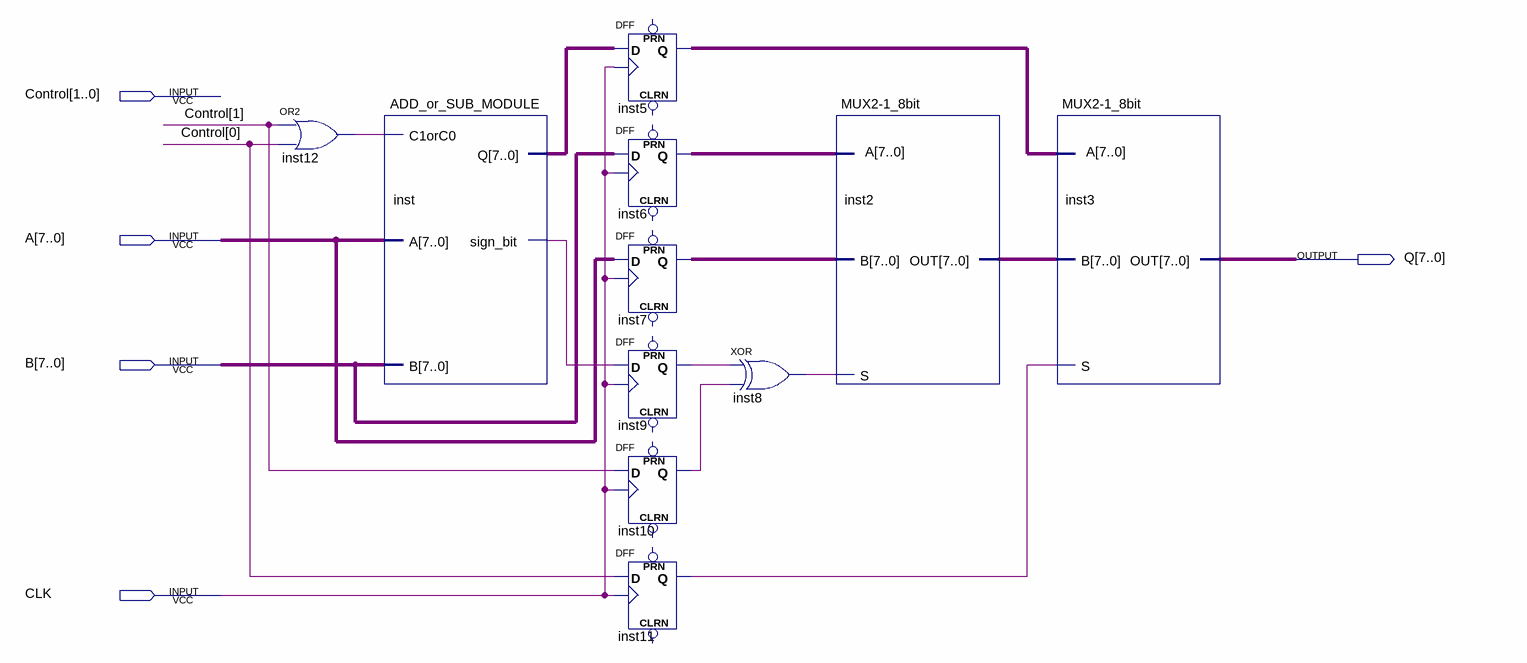
[diagram p0: schematic sheet]
// Quartus schematic AU_2.bdf as structural Verilog: 11 symbols, 5 pins
module AU_2 (
  input  [1:0] Control,
  input  [7:0] A,
  input  [7:0] B,
  input  CLK,
  output [7:0] Q
);

  wire inst8_out, inst9_q, inst10_q, inst11_q, inst12_out, inst_sign_bit;
  wire [7:0] inst2_out, inst5_q, inst6_q, inst7_q, inst_q;

  or inst12 (inst12_out, Control[1], Control[0]);
  ADD_or_SUB_MODULE inst (.B(B), .A(A), .C1orC0(inst12_out), .sign_bit(inst_sign_bit), .Q(inst_q));
  DFF inst5[7:0] (.CLK(CLK), .D(inst_q), .Q(inst5_q));  // open: CLRN, PRN
  DFF inst6[7:0] (.CLK(CLK), .D(B), .Q(inst6_q));  // open: CLRN, PRN
  DFF inst7[7:0] (.CLK(CLK), .D(A), .Q(inst7_q));  // open: CLRN, PRN
  DFF inst9 (.CLK(CLK), .D(inst_sign_bit), .Q(inst9_q));  // open: CLRN, PRN
  DFF inst10 (.CLK(CLK), .D(Control[1]), .Q(inst10_q));  // open: CLRN, PRN
  DFF inst11 (.CLK(CLK), .D(Control[0]), .Q(inst11_q));  // open: CLRN, PRN
  xor inst8 (inst8_out, inst9_q, inst10_q);
  \MUX2-1_8bit  inst2 (.S(inst8_out), .A(inst6_q), .B(inst7_q), .OUT(inst2_out));
  \MUX2-1_8bit  inst3 (.S(inst11_q), .A(inst5_q), .B(inst2_out), .OUT(Q));
endmodule
